# EAGLE design beteigeuze5 (EAGLE 4.16)
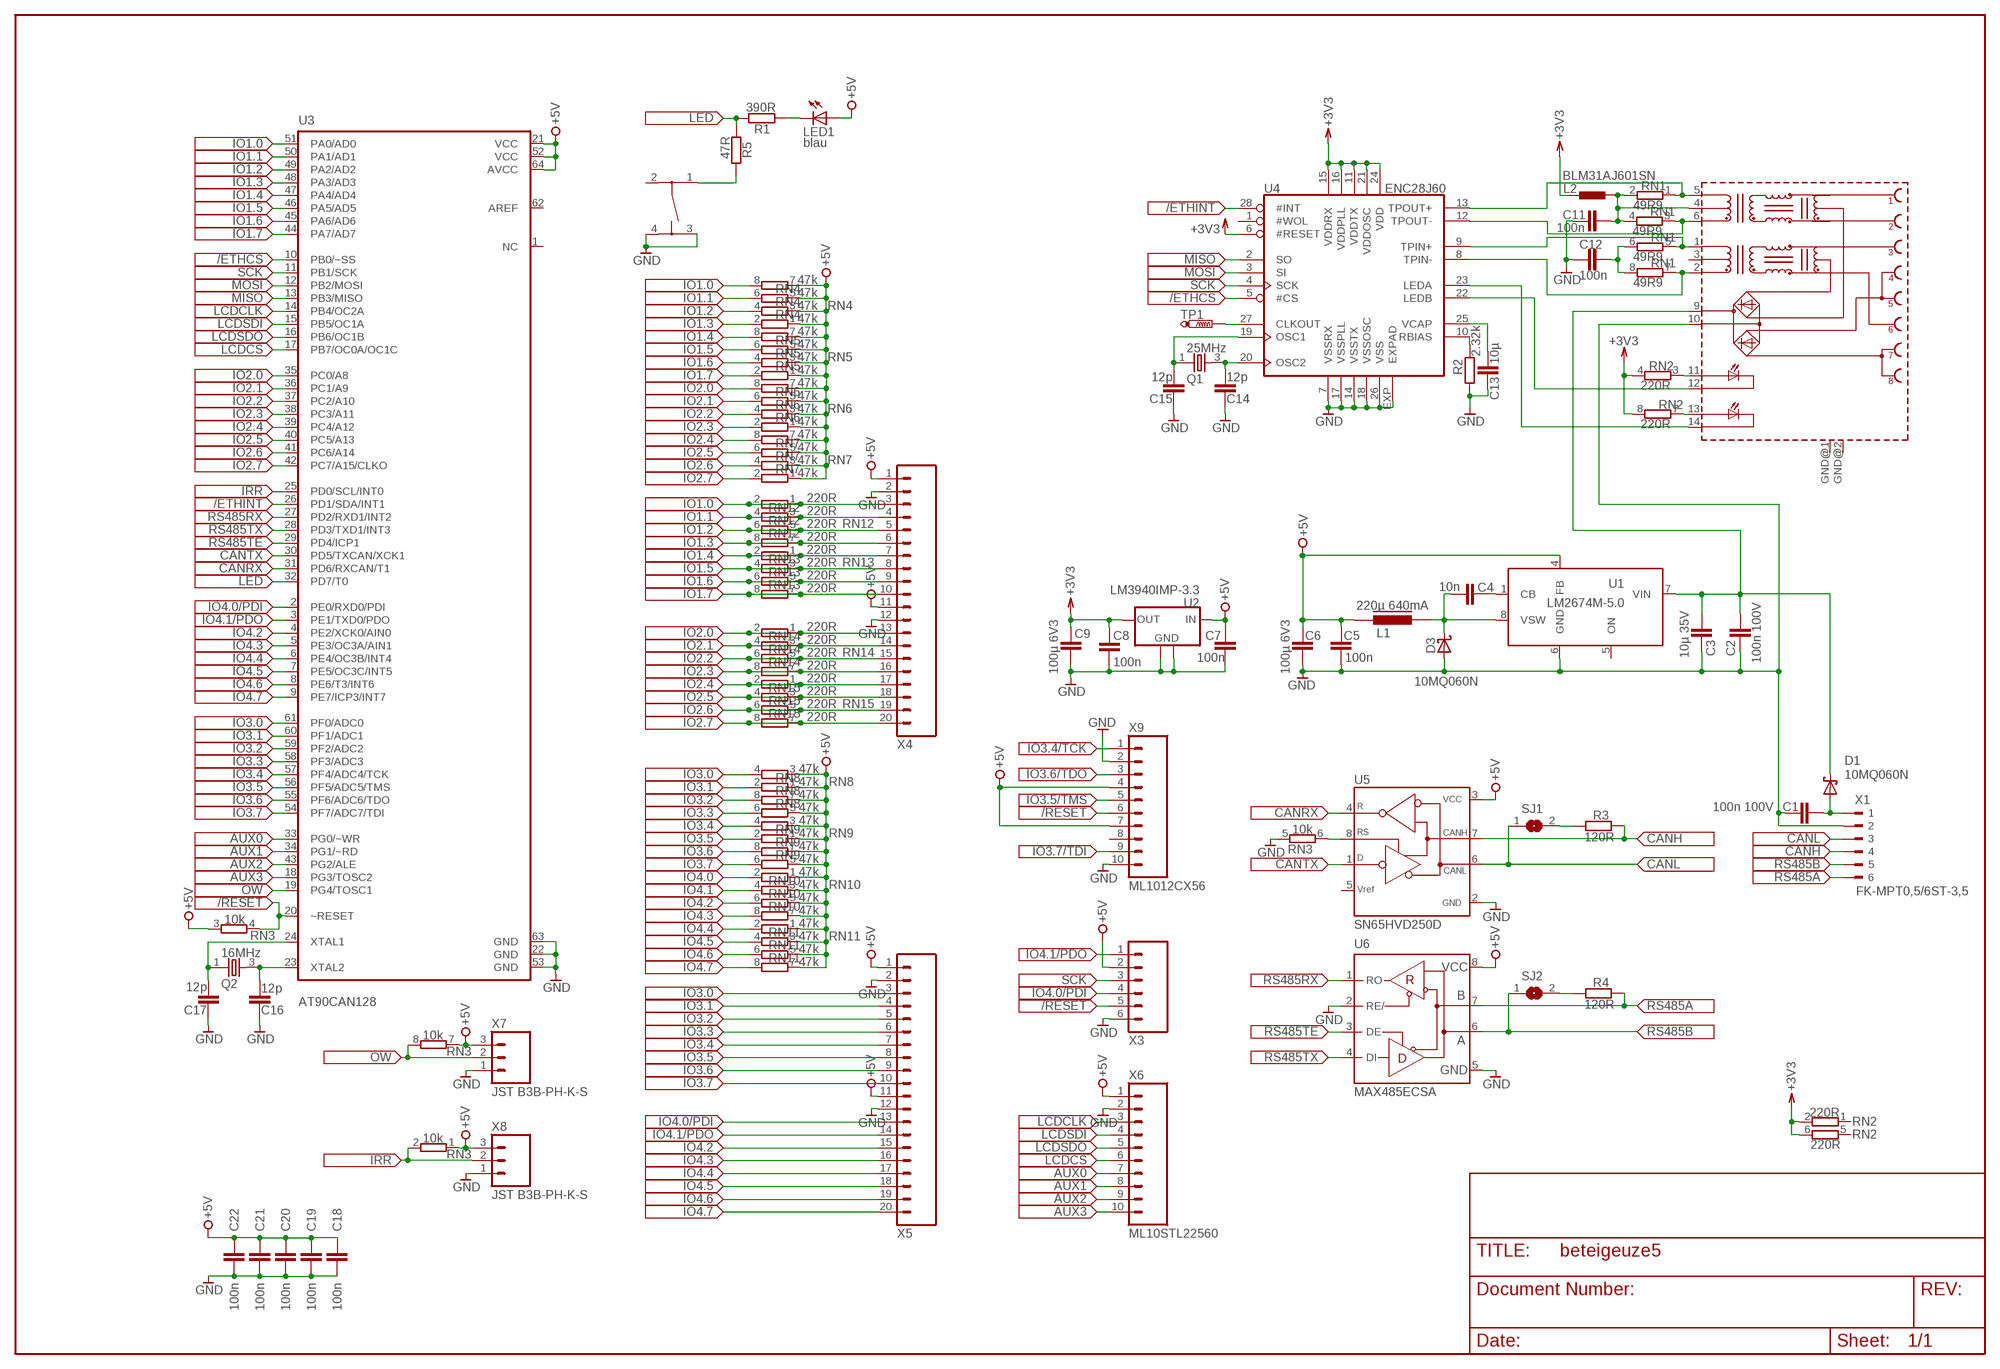
[diagram p0: schematic, sheet 1]

## Parts
C1  100n 100V  C-EUC1206  [C1206]
C2  100n 100V  C-EUC1206  [C1206]
C3  10µ 35V  C-EUC1210  [C1210]
C4  10n  C-EUC0603  [C0603]
C5  100n  C-EUC0603  [C0603]
C6  100µ 6V3  C-EUC1210  [C1210]
C7  100n  C-EUC0603  [C0603]
C8  100n  C-EUC0603  [C0603]
C9  100µ 6V3  C-EUC1210  [C1210]
C11  100n  C-EUC0603  [C0603]
C12  100n  C-EUC0603  [C0603]
C13  10µ  C-EUC0603  [C0603]
C14  12p  C-EUC0603  [C0603]
C15  12p  C-EUC0603  [C0603]
C16  12p  C-EUC0603  [C0603]
C17  12p  C-EUC0603  [C0603]
C18  100n  C-EUC0603  [C0603]
C19  100n  C-EUC0603  [C0603]
C20  100n  C-EUC0603  [C0603]
C21  100n  C-EUC0603  [C0603]
C22  100n  C-EUC0603  [C0603]
D1  10MQ060N  SCHOTTKY-DIODESMA  [SMA]
D3  10MQ060N  SCHOTTKY-DIODESMA  [SMA]
L1  220µ 640mA  07HCP  [07HCP]
L2  BLM31AJ601SN  L-EUL1206  [C1206K]
LED1  blau  LEDCHIP-LED0805  [CHIP-LED0805]
Q1  25MHz  QXO32  [XO32]
Q2  16MHz  QXO32  [XO32]
R1  390R  R-EU_0603  [C0603]
R2  2.32k  R-EU_0603  [C0603]
R3  120R  R-EU_0603  [C0603]
R4  120R  R-EU_0603  [C0603]
R5  47R  R-EU_0603  [C0603]
RN1  49R9  E4RP  [BCN16]
RN2  220R  E4RP  [BCN16]
RN3  10k  E4RP  [BCN16]
RN4  47k  E4RP  [BCN16]
RN5  47k  E4RP  [BCN16]
RN6  47k  E4RP  [BCN16]
RN7  47k  E4RP  [BCN16]
RN8  47k  E4RP  [BCN16]
RN9  47k  E4RP  [BCN16]
RN10  47k  E4RP  [BCN16]
RN11  47k  E4RP  [BCN16]
RN12  220R  E4RP  [BCN16]
RN13  220R  E4RP  [BCN16]
RN14  220R  E4RP  [BCN16]
RN15  220R  E4RP  [BCN16]
SJ1  SJN  [SJJ]
SJ2  SJN  [SJJ]
TP1  PTR1TP06R  [TP06R]
U1  LM2674M-5.0  LM2674M  [SO8]
U2  LM3940IMP-3.3  LM3940-3.3IMP  [SOT223]
U3  AT90CAN128  AT90CAN16AU  [TQFP64]
U4  ENC28J60  ENC28J60I/ML  [QNF28]
U5  SN65HVD250D  SN65HVD230DESA  [SO8]
U6  MAX485ECSA  MAX3072ECSA  [SO8]
U$1  MENTOR1254PHAP3301  [PHAP3301]
X1  FK-MPT0,5/6ST-3,5  [FK-MPT0,5/6ST-3,5]
X3  ML6M  [STL22-560LPGGG6]
X4  ML20STL22-560  [STL22-560LPGGG20]
X5  ML20STL22-560  [STL22-560LPGGG20]
X6  ML10STL22560  [STL22-560LPGGG10]
X7  JST B3B-PH-K-S  CON03PPH-K-S  [B3B-PH-K-S]
X8  JST B3B-PH-K-S  CON03PPH-K-S  [B3B-PH-K-S]
X9  ML1012CX56  [12CX56-010G]
X10  MIC66211-5171MIC66211-5171  [RJPLB-203TC1X]

## Nets
+3V3: C8.2 C9.2 L2.1 RN2.2 RN2.4 RN2.6 RN2.8 U2.3(OUT) U4.6(#RESET) U4.11(VDDTX) U4.15(VDDRX) U4.16(VDDPLL) U4.21(VDDOSC) U4.24(VDD)
+5V: C5.2 C6.2 C7.2 C18.2 C19.2 C20.2 C21.2 C22.2 L1.1 LED1.A RN3.1 RN3.3 RN3.7 RN4.1 RN4.3 RN4.5 RN4.7 RN5.1 RN5.3 RN5.5 RN5.7 RN6.1 RN6.3 RN6.5 RN6.7 RN7.1 RN7.3 RN7.5 RN7.7 RN8.1 RN8.3 RN8.5 RN8.7 RN9.1 RN9.3 RN9.5 RN9.7 RN10.1 RN10.3 RN10.5 RN10.7 RN11.1 RN11.3 RN11.5 RN11.7 U1.4(FB) U2.1(IN) U3.21(VCC) U3.52(VCC) U3.64(AVCC) U5.3(VCC) U6.8(VCC) X3.2 X4.1 X4.11 X5.1 X5.11 X6.1 X7.3 X8.3 X9.4 X9.7
/ETHCS: U3.10(PB0/~SS) U4.5(#CS)
/ETHINT: U3.26(PD1/SDA/INT1) U4.28(#INT)
/RESET: RN3.4 U3.20(~RESET) X3.5 X9.6
AUX0: U3.33(PG0/~WR) X6.7
AUX1: U3.34(PG1/~RD) X6.8
AUX2: U3.43(PG2/ALE) X6.9
AUX3: U3.18(PG3/TOSC2) X6.10
CANH: R3.2 U5.7(CANH) X1.4
CANL: SJ1.1 U5.6(CANL) X1.3
CANRX: U3.31(PD6/RXCAN/T1) U5.4(R)
CANTX: U3.30(PD5/TXCAN/XCK1) U5.1(D)
CB: C4.1 U1.1(CB)
GND: C1.1 C2.2 C3.1 C5.1 C6.1 C7.1 C8.1 C9.1 C11.1 C12.1 C13.1 C14.1 C15.1 C16.1 C17.1 C18.1 C19.1 C20.1 C21.1 C22.1 D3.A R2.1 RN3.5 U1.6(GND) U2.2(GND) U2.4(GND) U3.22(GND) U3.53(GND) U3.63(GND) U4.7(VSSRX) U4.14(VSSTX) U4.17(VSSPLL) U4.18(VSSOSC) U4.26(VSS) U4.EXP(EXPAD) U5.2(GND) U6.2(RE/) U6.5(GND) U$1.3(A) U$1.4(A) X1.2 X3.6 X4.2 X4.12 X5.2 X5.12 X6.2 X7.1 X8.1 X9.2 X9.10 X10.10(PW-)
IO1.0: RN4.8 RN12.1 RN12.2 U3.51(PA0/AD0) X4.3
IO1.1: RN4.6 RN12.3 RN12.4 U3.50(PA1/AD1) X4.4
IO1.2: RN4.4 RN12.5 RN12.6 U3.49(PA2/AD2) X4.5
IO1.3: RN4.2 RN12.7 RN12.8 U3.48(PA3/AD3) X4.6
IO1.4: RN5.8 RN13.1 RN13.2 U3.47(PA4/AD4) X4.7
IO1.5: RN5.6 RN13.3 RN13.4 U3.46(PA5/AD5) X4.8
IO1.6: RN5.4 RN13.5 RN13.6 U3.45(PA6/AD6) X4.9
IO1.7: RN5.2 RN13.7 RN13.8 U3.44(PA7/AD7) X4.10
IO2.0: RN6.8 RN14.1 RN14.2 U3.35(PC0/A8) X4.13
IO2.1: RN6.6 RN14.3 RN14.4 U3.36(PC1/A9) X4.14
IO2.2: RN6.4 RN14.5 RN14.6 U3.37(PC2/A10) X4.15
IO2.3: RN6.2 RN14.7 RN14.8 U3.38(PC3/A11) X4.16
IO2.4: RN7.8 RN15.1 RN15.2 U3.39(PC4/A12) X4.17
IO2.5: RN7.6 RN15.3 RN15.4 U3.40(PC5/A13) X4.18
IO2.6: RN7.4 RN15.5 RN15.6 U3.41(PC6/A14) X4.19
IO2.7: RN7.2 RN15.7 RN15.8 U3.42(PC7/A15/CLKO) X4.20
IO3.0: RN8.4 U3.61(PF0/ADC0) X5.3
IO3.1: RN8.2 U3.60(PF1/ADC1) X5.4
IO3.2: RN8.8 U3.59(PF2/ADC2) X5.5
IO3.3: RN8.6 U3.58(PF3/ADC3) X5.6
IO3.4: RN9.4 U3.57(PF4/ADC4/TCK) X5.7 X9.1
IO3.5: RN9.2 U3.56(PF5/ADC5/TMS) X5.8 X9.5
IO3.6: RN9.8 U3.55(PF6/ADC6/TDO) X5.9 X9.3
IO3.7: RN9.6 U3.54(PF7/ADC7/TDI) X5.10 X9.9
IO4.0/PDI: RN10.2 U3.2(PE0/RXD0/PDI) X3.4 X5.13
IO4.1/PDO: RN10.4 U3.3(PE1/TXD0/PDO) X3.1 X5.14
IO4.2: RN10.6 U3.4(PE2/XCK0/AIN0) X5.15
IO4.3: RN10.8 U3.5(PE3/OC3A/AIN1) X5.16
IO4.4: RN11.2 U3.6(PE4/OC3B/INT4) X5.17
IO4.5: RN11.4 U3.7(PE5/OC3C/INT5) X5.18
IO4.6: RN11.6 U3.8(PE6/T3/INT6) X5.19
IO4.7: RN11.8 U3.9(PE7/ICP3/INT7) X5.20
IRR: RN3.2 U3.25(PD0/SCL/INT0) X8.2
KEY: R5.2 U$1.1(B)
LCDCLK: U3.14(PB4/OC2A) X6.3
LCDCS: U3.17(PB7/OC0A/OC1C) X6.6
LCDSDI: U3.15(PB5/OC1A) X6.4
LCDSDO: U3.16(PB6/OC1B) X6.5
LED: R1.2 R5.1 U3.32(PD7/T0)
LEDA: U4.23(LEDA) X10.14(D2K)
LEDB: U4.22(LEDB) X10.12(D1K)
MISO: U3.13(PB3/MISO) U4.2(SO)
MOSI: U3.12(PB2/MOSI) U4.3(SI)
N$1: TP1.TP U4.27(CLKOUT)
N$7: C11.2 L2.2 RN1.2 RN1.4 X10.4(TCT)
N$8: C12.2 RN1.6 RN1.8
N$14: LED1.C R1.1
N$23: RN3.6 U5.8(RS)
N$24: R3.1 SJ1.2
N$25: RN2.3 X10.11(D1A)
N$26: R4.1 SJ2.2
N$29: RN2.7 X10.13(D2A)
OSC1: C15.2 Q1.1 U4.19(OSC1)
OSC2: C14.2 Q1.3 U4.20(OSC2)
OW: RN3.8 U3.19(PG4/TOSC1) X7.2
RBIAS: R2.2 U4.10(RBIAS)
RS485A: R4.2 U6.7(B) X1.6
RS485B: SJ2.1 U6.6(A) X1.5
RS485RX: U3.27(PD2/RXD1/INT2) U6.1(RO)
RS485TE: U3.29(PD4/ICP1) U6.3(DE)
RS485TX: U3.28(PD3/TXD1/INT3) U6.4(DI)
SCK: U3.11(PB1/SCK) U4.4(SCK) X3.3
TPIN+: RN1.5 U4.9(TPIN+) X10.1(RD+)
TPIN-: RN1.7 U4.8(TPIN-) X10.2(RD-)
TPOUT+: RN1.1 U4.13(TPOUT+) X10.5(TD+)
TPOUT-: RN1.3 U4.12(TPOUT-) X10.6(TD-)
VCAP: C13.2 U4.25(VCAP)
VIN: C2.1 C3.2 D1.C U1.7(VIN) X10.9(PW+)
VSUP: C1.2 D1.A X1.1
VSW: C4.2 D3.C L1.2 U1.8(VSW)
XTAL1: C17.2 Q2.1 U3.24(XTAL1)
XTAL2: C16.2 Q2.3 U3.23(XTAL2)
Unconnected: RN2.1 RN2.5 U1.5(ON) U3.1(NC) U3.62(AREF) U4.1(#WOL) U5.5(VREF) U$1.2(B) X9.8 X10.3(RCT) X10.GND@1(SHLD) X10.GND@2(SHLD)

## Library data of the parts
C1-C9 C11-C22 = rcl:C-EU: CAPACITOR, European symbol
D1 D3 = diode:SCHOTTKY-DIODE: Schottky Diode
L1 = inductor-fastron:07HCP
L2 = rcl:L-EU: INDUCTOR, European symbol
LED1 = led:LED: LED OSRAM: - CHIPLED LG R971, LG N971, LY N971, LG Q971, LY Q971, LO R971, LY R971 LH N974, LH R974 LS Q976, LO Q976, LY Q976 LO Q996 - Hyper CHIPLED LW Q18S LB Q993, LB Q99A, LB R99A - SideLED LS A670, LO A670, LY A670, LG A670, LP A670 LB A673, LV A673, LT A673, LW A673 LH A674 LY A675 LS A676, LA A676, LO A676, LY A676, LW A676 LS A679, LY A679, LG A679 - Hyper Micro SIDELED® LS Y876, LA Y876, LO Y876, LY Y876 LT Y87S - SmartLED LW L88C, LW L88S LB L89C, LB L89S, LG L890 LS L89K, LO L89K, LY L89K LS L896, LA L896, LO L896, LY L896 - TOPLED LS T670, LO T670, LY T670, LG T670, LP T670 LSG T670, LSP T670, LSY T670, LOP T670, LYG T670 LG T671, LOG T671, LSG T671 LB T673, LV T673, LT T673, LW T673 LH T674 LS T676, LA T676, LO T676, LY T676, LB T676, LH T676, LSB T676, LW T676 LB T67C, LV T67C, LT T67C, LS T67K, LO T67K, LY T67K, LW E67C LS E67B, LA E67B, LO E67B, LY E67B, LB E67C, LV E67C, LT E67C LW T67C LS T679, LY T679, LG T679 LS T770, LO T770, LY T770, LG T770, LP T770 LB T773, LV T773, LT T773, LW T773 LH T774 LS E675, LA E675, LY E675, LS T675 LS T776, LA T776, LO T776, LY T776, LB T776 LHGB T686 LT T68C, LB T68C - Hyper Mini TOPLED® LB M676 - Mini TOPLED Santana® LG M470 LS M47K, LO M47K, LY M47K Source: http://www.osram.convergy.de - LUMILED® LXK2-PW12-R00, LXK2-PW12-S00, LXK2-PW14-U00, LXK2-PW14-V00 LXK2-PM12-R00, LXK2-PM12-S00, LXK2-PM14-U00 LXK2-PE12-Q00, LXK2-PE12-R00, LXK2-PE12-S00, LXK2-PE14-T00, LXK2-PE14-U00 LXK2-PB12-K00, LXK2-PB12-L00, LXK2-PB12-M00, LXK2-PB14-N00, LXK2-PB14-P00, LXK2-PB14-Q00 LXK2-PR12-L00, LXK2-PR12-M00, LXK2-PR14-Q00, LXK2-PR14-R00 LXK2-PD12-Q00, LXK2-PD12-R00, LXK2-PD12-S00 LXK2-PH12-R00, LXK2-PH12-S00 LXK2-PL12-P00, LXK2-PL12-Q00, LXK2-PL12-R00 Source: www.luxeon.com
Q1 Q2 = _frank:Q: CRYSTAL
R1-R5 = rcl:R-EU_: RESISTOR, European symbol
RN1-RN15 = _frank:E4RP: SIL RESISTOR
SJ1 SJ2 = jumper:SJ: SMD solder JUMPER
TP1 = testpad:PTR1: TEST PIN
U1 = lm-switching-regulator:LM2674
U2 = v-reg:LM3940*-3.3
U3 = AT90CAN:AT90CAN
U4 = ENC28J60:ENC28J60
U5 = _frank:SN65HVD230D: CANBUS TRANSEIVER
U6 = _frank:MAX3072E
U$1 = switch:MENTOR1254
X1 = con-phoenix-fkmpt35:FK-MPT0,5/6ST-3,5
X3 = con-harting-ml:ML6: HARTING
X4 X5 = con-harting-ml:ML20: HARTING
X6 X9 = con-harting-ml:ML10: HARTING
X7 X8 = _frank:CON03P
X10 = _frank:MIC66211-5171

## Board
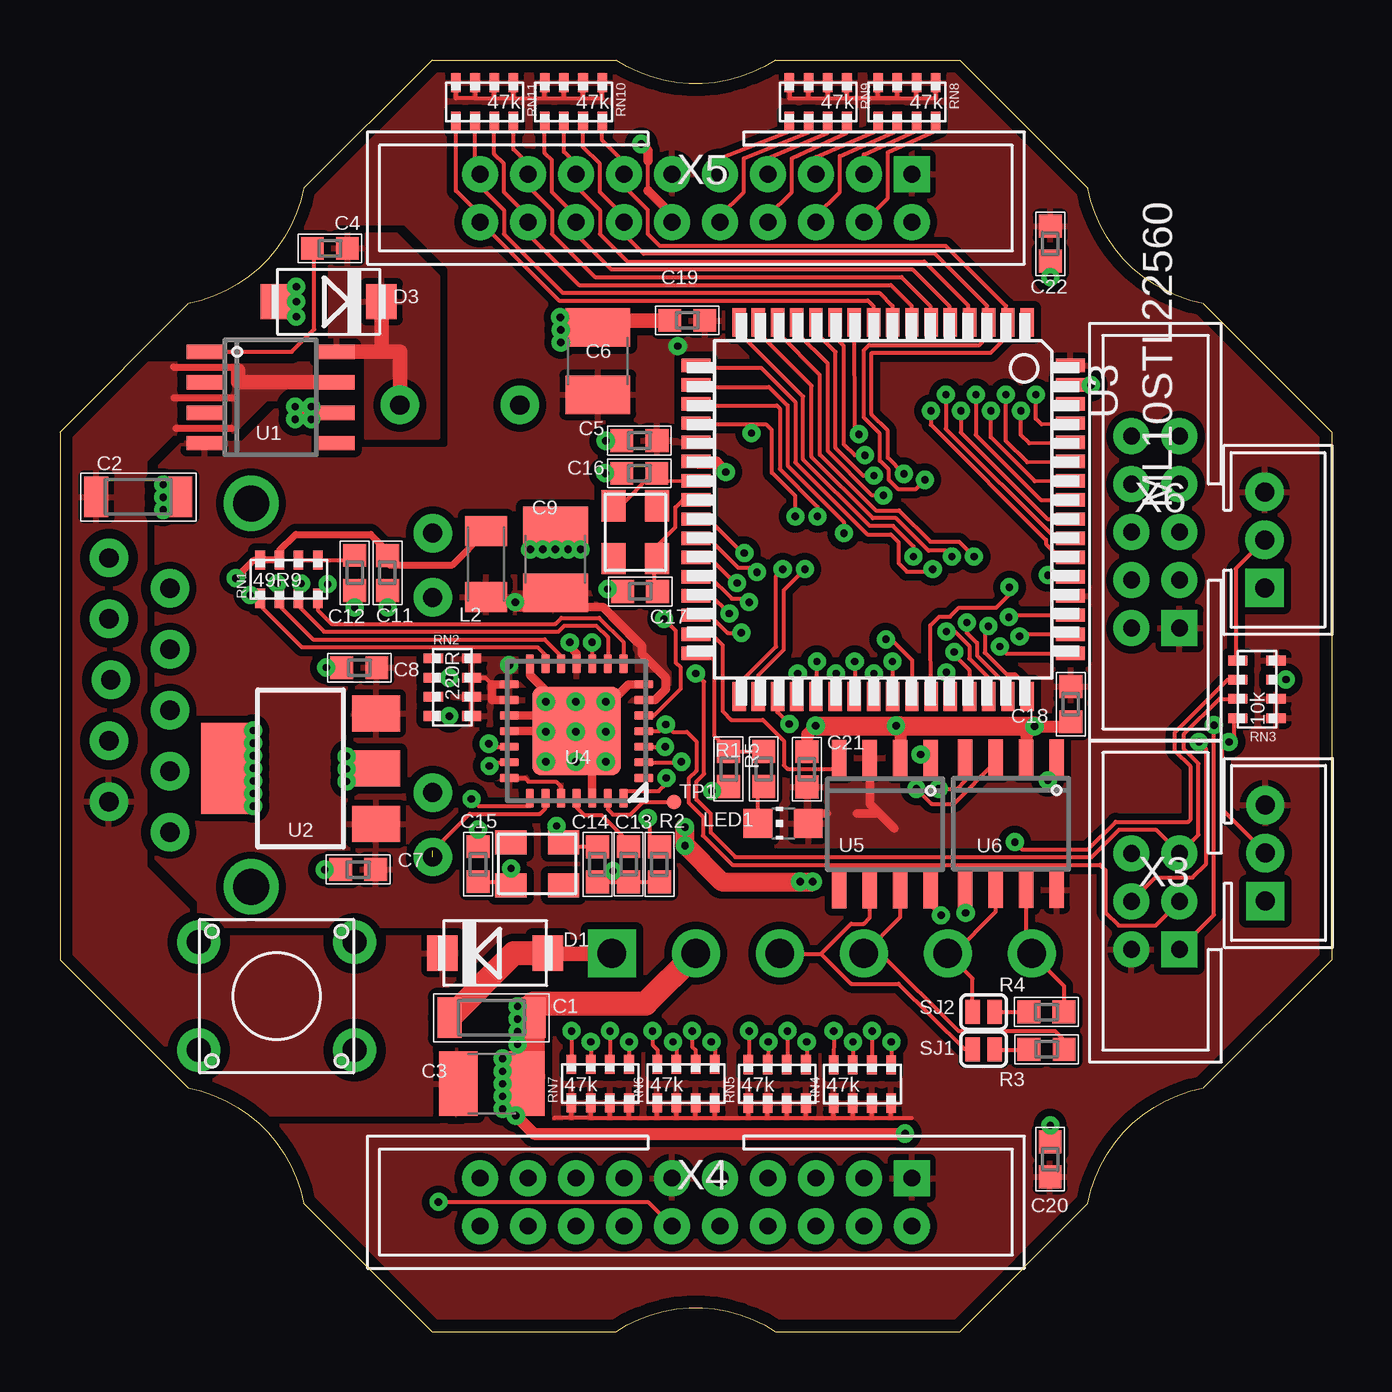
[diagram p1: board, top side]
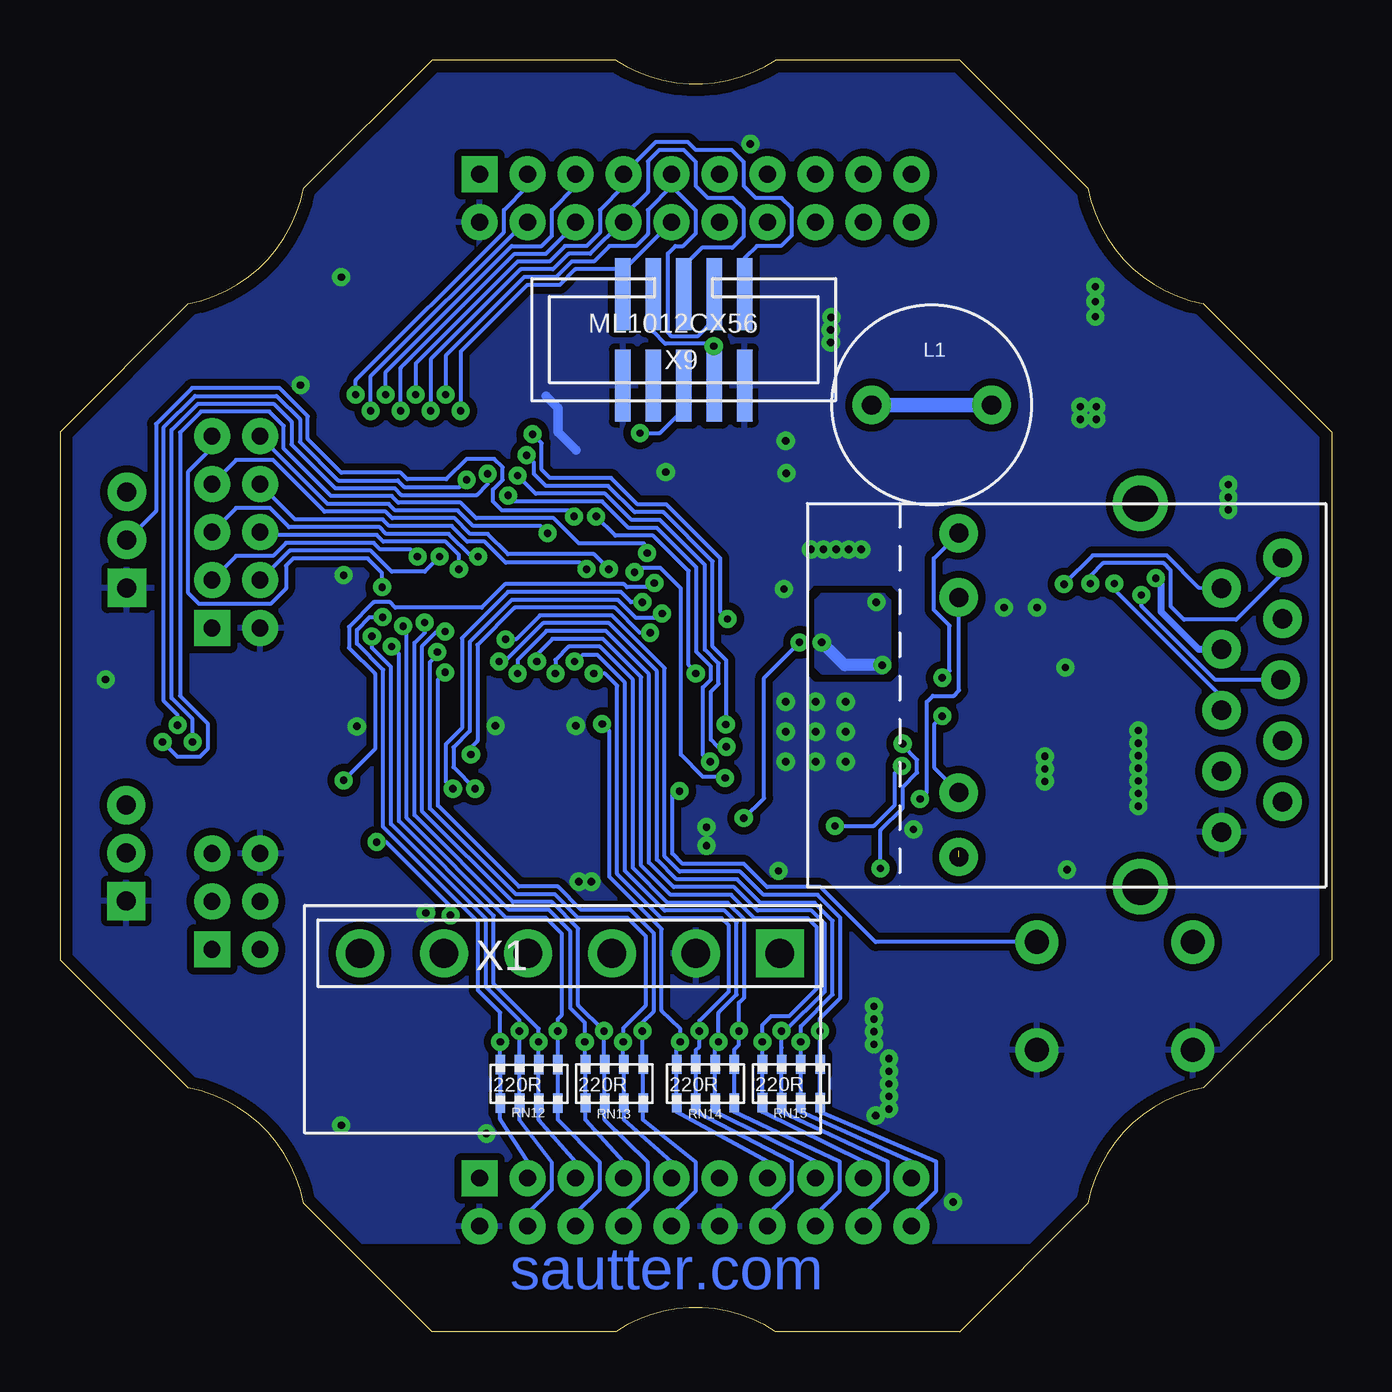
[diagram p2: board, bottom side, seen from below]

Size 53 x 53 mm. Coordinates in mm from the lower left corner, seen from the top.
Outline: 37.5,53 42.85,47.65 arc69 47.65,42.85 53,37.5 53,15.5 47.65,10.15 arc69 42.85,5.35 37.5,0 29.82,0 arc67 23.18,0 15.5,0 10.15,5.35 arc69 5.35,10.15 0,15.5 0,37.5 5.35,42.85 arc69 10.15,47.65 15.5,53 23.18,53 arc67 29.82,53 37.5,53
Copper layers (1*16): Top 0.035mm / dielectric 1.5mm / Bottom 0.035mm
Design rules "default": minimum track width 6mil, minimum drill 0.3mm, track to track 6mil, track to pad 6mil, pad to pad 6mil, via to via 6mil, smd to smd 6mil, copper to edge 20mil, drill to drill 8mil, minimum pad ring 0.4mm, minimum via ring 9mil, stop-mask expansion 6mil, vias tented up to drill 13mil, thermal gap 10mil

### Footprints (pad centres in the part's own frame; a part is rotated, then mirrored left to right if it is on the bottom)
C1206 = smd 1 x 1.7: 1 -1.75,0; 2 1.75,0
C1210 = smd 1.6 x 2.7: 1 -1.4,0; 2 1.4,0
C0603 = smd 0.95 x 0.95: 1 -0.731,0; 2 0.731,0
SMA = smd 1.27 x 1.473: A 2.2,0; C -2.2,0
07HCP = drill 0.8 round: 1 -2.5,0; 2 2.5,0
C1206K = smd 1.25 x 1.75: 1 -1.375,0; 2 1.375,0
CHIP-LED0805 = smd 1.2 x 1.2: A 0,-1.05; C 0,1.05
XO32 = smd 1.3 x 1: 1 -1.1,-0.9; 2 1.1,-0.9; 3 1.1,0.9; 4 -1.1,0.9
BCN16 = smd 0.4 x 0.8: 1 -1.2,-0.8; 2 -1.2,0.8; 3 -0.4,-0.8; 4 -0.4,0.8; 5 0.4,-0.8; 6 0.4,0.8; 7 1.2,-0.8; 8 1.2,0.8
SJJ = smd 0.6 x 1: 1 -0.462,0; 2 0.462,0
TP06R = smd 0.6 x 0.6: TP 0,0
SO8 = smd 0.6 x 1.5: 1 -1.905,-2.759; 2 -0.635,-2.759; 3 0.635,-2.759; 4 1.905,-2.759; 5 1.905,2.759; 6 0.635,2.759; 7 -0.635,2.759; 8 -1.905,2.759
SOT223 = smd 1.5 x 2: 1 -2.3,-3.15; 2 0,-3.15; 3 2.3,-3.15 | smd 3.8 x 2: 4 0,3.15
TQFP64 = smd 1.2 x 0.56: 1 -7.8,6; 2 -7.8,5.2; 3 -7.8,4.4; 4 -7.8,3.6; 5 -7.8,2.8; 6 -7.8,2; 7 -7.8,1.2; 8 -7.8,0.4; 9 -7.8,-0.4; 10 -7.8,-1.2; 11 -7.8,-2; 12 -7.8,-2.8; 13 -7.8,-3.6; 14 -7.8,-4.4; 15 -7.8,-5.2; 16 -7.8,-6; 33 7.8,-6; 34 7.8,-5.2; 35 7.8,-4.4; 36 7.8,-3.6; 37 7.8,-2.8; 38 7.8,-2; 39 7.8,-1.2; 40 7.8,-0.4; 41 7.8,0.4; 42 7.8,1.2; 43 7.8,2; 44 7.8,2.8; 45 7.8,3.6; 46 7.8,4.4; 47 7.8,5.2; 48 7.8,6 | smd 0.56 x 1.2: 17 -6,-7.8; 18 -5.2,-7.8; 19 -4.4,-7.8; 20 -3.6,-7.8; 21 -2.8,-7.8; 22 -2,-7.8; 23 -1.2,-7.8; 24 -0.4,-7.8; 25 0.4,-7.8; 26 1.2,-7.8; 27 2,-7.8; 28 2.8,-7.8; 29 3.6,-7.8; 30 4.4,-7.8; 31 5.2,-7.8; 32 6,-7.8; 49 6,7.8; 50 5.2,7.8; 51 4.4,7.8; 52 3.6,7.8; 53 2.8,7.8; 54 2,7.8; 55 1.2,7.8; 56 0.4,7.8; 57 -0.4,7.8; 58 -1.2,7.8; 59 -2,7.8; 60 -2.8,7.8; 61 -3.6,7.8; 62 -4.4,7.8; 63 -5.2,7.8; 64 -6,7.8
QNF28 = smd 0.8 x 0.35: 1 -2.8,1.95; 2 -2.8,1.3; 3 -2.8,0.65; 4 -2.8,0; 5 -2.8,-0.65; 6 -2.8,-1.3; 7 -2.8,-1.95; 15 2.8,-1.95; 16 2.8,-1.3; 17 2.8,-0.65; 18 2.8,0; 19 2.8,0.65; 20 2.8,1.3; 21 2.8,1.95 | smd 0.35 x 0.8: 8 -1.95,-2.8; 9 -1.3,-2.8; 10 -0.65,-2.8; 11 0,-2.8; 12 0.65,-2.8; 13 1.3,-2.8; 14 1.95,-2.8; 22 1.95,2.8; 23 1.3,2.8; 24 0.65,2.8; 25 0,2.8; 26 -0.65,2.8; 27 -1.3,2.8; 28 -1.95,2.8 | smd 3.7 x 3.7: EXP 0,0
PHAP3301 = drill 1 pad 1.4 round: 1 -3.25,-2.25; 2 3.25,-2.25; 3 -3.25,2.25; 4 3.25,2.25
FK-MPT0,5/6ST-3,5 = drill 1.2 pad 2 square: 1 -8.75,0 | drill 1.2 pad 2 round: 2 -5.25,0; 3 -1.75,0; 4 1.75,0; 5 5.25,0; 6 8.75,0
STL22-560LPGGG6 = drill 0.7 square: 1 -2,-1 | drill 0.7 round: 2 -2,1; 3 0,-1; 4 0,1; 5 2,-1; 6 2,1
STL22-560LPGGG20 = drill 0.7 square: 1 -9,-1 | drill 0.7 round: 2 -9,1; 3 -7,-1; 4 -7,1; 5 -5,-1; 6 -5,1; 7 -3,-1; 8 -3,1; 9 -1,-1; 10 -1,1; 11 1,-1; 12 1,1; 13 3,-1; 14 3,1; 15 5,-1; 16 5,1; 17 7,-1; 18 7,1; 19 9,-1; 20 9,1
STL22-560LPGGG10 = drill 0.7 square: 1 -4,-1 | drill 0.7 round: 2 -4,1; 3 -2,-1; 4 -2,1; 5 0,-1; 6 0,1; 7 2,-1; 8 2,1; 9 4,-1; 10 4,1
B3B-PH-K-S = drill 0.8 pad 1.4 square: 1 0,-2 | drill 0.8 pad 1.4 round: 2 0,0; 3 0,2
12CX56-010G = smd 0.65 x 3: 1 -2.54,-1.905; 2 -2.54,1.905; 3 -1.27,-1.905; 4 -1.27,1.905; 5 0,-1.905; 6 0,1.905; 7 1.27,-1.905; 8 1.27,1.905; 9 2.54,-1.905; 10 2.54,1.905
RJPLB-203TC1X = drill 0.8 pad 1.4 round: 1 -5.715,8.97; 2 -4.445,6.43; 3 -3.175,8.97; 4 -1.905,6.43; 5 -0.635,8.89; 6 0.635,6.43; 7 1.905,8.97; 8 3.175,6.43; 9 4.445,8.97; 10 5.715,6.43; 11 -6.747,-4.524; 12 -4.067,-4.524; 13 4.067,-4.524; 14 6.747,-4.524 | drill 1.5 round: GND@1 -7.99,3.046; GND@2 7.99,3.046

### Placement (x,y rotation side)
C1  17.98,13.08 180 top
C2  3.27,34.79 0 top
C3  18,10.33 180 top
C4  11.25,45.15 0 top
C5  24.15,37.13 0 top
C6  22.42,40.45 270 top
C7  12.43,19.25 0 top
C8  12.47,27.67 0 top
C9  20.65,32.19 270 top
C11  13.65,31.62 90 top
C12  12.29,31.62 90 top
C13  23.7,19.48 90 top
C14  22.4,19.47 90 top
C15  17.43,19.48 270 top
C16  24.14,35.77 0 top
C17  24.18,30.85 0 top
C18  42.13,26.15 90 top
C19  26.14,42.15 0 top
C20  41.27,7.18 270 top
C21  31.13,23.43 270 top
C22  41.27,45.34 90 top
D1  18.14,15.77 0 top
D3  11.2,42.92 180 top
L1  16.67,38.62 180 bottom
L2  17.76,31.99 90 top
LED1  30.14,21.18 90 top
Q1  19.89,19.5 0 top
Q2  23.98,33.31 90 top
R1  29.33,23.45 90 top
R2  24.98,19.47 90 top
R3  41.12,11.77 0 top
R4  41.12,13.32 0 top
R5  27.87,23.45 270 top
RN1  9.54,31.36 0 top
RN2  16.36,26.86 270 top
RN3  49.89,26.77 90 top
RN4  33.45,10.32 0 top
RN5  29.89,10.32 0 top
RN6  26.09,10.33 0 top
RN7  22.52,10.34 0 top
RN8  35.3,51.25 180 top
RN9  31.6,51.25 180 top
RN10  21.4,51.25 180 top
RN11  17.7,51.25 180 top
RN12  33.45,10.32 0 bottom
RN13  29.89,10.33 0 bottom
RN14  26.09,10.34 0 bottom
RN15  22.52,10.34 0 bottom
SJ1  38.5,11.77 0 top
SJ2  38.5,13.32 0 top
TP1  25.6,22.07 0 top
U1  8.78,38.94 270 top
U2  10.03,23.46 90 top
U3  34.31,34.27 270 top
U4  21.54,25.02 180 top
U5  34.39,21.15 180 top
U6  39.64,21.17 180 top
U$1  9.03,13.98 180 top
X1  31.75,15.77 180 bottom
X3  45.66,17.93 90 top
X4  26.5,5.39 180 top
X5  26.5,47.24 180 top
X6  45.66,33.32 90 top
X7  50.22,32.99 0 top
X8  50.24,19.95 0 top
X9  27,41.34 180 bottom
X10  11.01,26.53 270 bottom

### Tracks (layer width: path | path; a pad name or v marks a point on that pad's centre or on a via)
+3V3  (via drill 0.3)
  Top 0.16: RN2.4 17.18,27.25 17.16,27.23 | RN2.4 17.16,27.23 | RN2.4 | RN2.4 | RN2.4 | RN2.4 17.72,27.25 18,26.98 | RN2.8 17.15,26.45 | RN2.6 17.15,27.23 17.16,27.23 | U4.21 19.38,23.07 19.52,22.93 20.68,22.93 20.88,22.73 20.88,22.23 U4.24
  Top 0.35: U4.11 21.54,28.27 21.25,28.55 v21.25,28.73 | U4.6 24.8,26.32 25.25,26.77 25.25,27.25 24.25,28.25 24.25,28.57 22.62,30.2 | U4.15 18,26.98 18,26.32 U4.16 | 22.62,30.2 21.48,30.2 20.12,30.2 | 22.62,30.2 24.05,28.75
  Top 0.4: L2.1 17.75,30.62 | L2.1 | L2.1 17.75,30.4 v18.98,30.4 18.98,30.2 21.48,30.2
  Bottom 0.5: v21.25,28.73 20.3,27.77 v18.73,27.77
  pour Top (isolate 0.3): 12.25,29.75 16.25,29.75 16.25,31.5 22.75,31.5 22.75,30.5 27,30.5 27,22.25 14.47,22.2 14.47,24.45 12.22,24.45
  pour Bottom (isolate 0.3, no thermals): 18.43,27.73 18.43,30.45 18.68,30.7 21.25,30.7 21.5,30.45 21.5,27.73 21.25,27.48 18.68,27.48
+5V  (via drill 0.3)
  Top 0.16: RN5.1 28.7,8.9 | 29.5,8.9 30.3,8.9 | 28.7,8.9 29.5,8.9 | 30.3,8.9 31.1,8.9 | 31.1,8.9 32.25,8.9 | 32.25,8.9 33.05,8.9 | 33.05,8.9 33.85,8.9 | 33.85,8.9 34.65,8.9 | 32.25,8.9 32.25,9 32.24,9 RN4.1 | RN4.3 33.05,8.9 | RN4.5 33.84,8.9 33.85,8.9 | 34.65,8.9 RN4.7 | 34.65,8.9 | RN5.7 31.09,8.9 31.1,8.9 | RN5.5 30.3,8.9 | RN5.3 29.5,8.9 | RN7.1 21.32,8.9 | 22.12,8.9 21.32,8.9 | 22.12,8.9 22.93,8.9 | 22.93,8.9 23.73,8.9 | 23.73,8.9 24.9,8.9 | 24.9,8.9 25.52,8.9 | 25.52,8.9 25.7,8.9 | 25.7,8.9 26.5,8.9 | 26.5,8.9 27.3,8.9 | RN6.7 27.3,8.9 | RN6.5 26.5,8.9 | RN6.3 25.7,8.9 | RN6.1 24.89,8.9 24.9,8.9 | RN7.5 22.92,8.9 22.93,8.9 | RN7.7 23.72,8.9 23.73,8.9 | RN7.3 22.12,8.9 | 27.3,8.9 28.7,8.9 | 25.52,8.9 25.5,8.9 | X4.11 25.52,6.42 | 34.65,8.9 35.5,8.9 | X4.1 | RN9.7 30.4,51.4 31.2,51.4 | 31.2,51.4 RN9.5 | 32,51.4 RN9.3 | 32.8,51.4 RN9.1 | 34.1,51.4 RN8.7 | 34.9,51.4 RN8.5 | 35.7,51.4 RN8.3 | RN8.1 36.5,51.4 35.7,51.4 | RN11.7 16.5,51.4 17.3,51.4 | RN11.5 17.3,51.4 | 18.1,51.4 RN11.3 | 17.3,51.4 18.1,51.4 | 18.9,51.4 RN11.1 | 18.1,51.4 18.9,51.4 | 20.2,51.4 RN10.7 | 18.9,51.4 20.2,51.4 | 21,51.4 RN10.5 | 20.2,51.4 21,51.4 | 21.8,51.4 RN10.3 | 21,51.4 21.8,51.4 | RN10.1 22.6,51.4 21.8,51.4 | 31.2,51.4 32,51.4 | 32,51.4 32.8,51.4 | 34.1,51.4 32.8,51.4 | 34.9,51.4 34.1,51.4 | 34.9,51.4 35.7,51.4 | 31.2,51.4 34.9,51.4 | 21.32,8.9 20.6,8.9
  Top 0.3: 21.77,38.62 21.77,38.6 22.42,38.6 C6.2
  Top 0.35: U5.3 33.76,22 34.15,21.6 | 34.15,21.6 34.77,20.98 | LED1.A 31.2,21.6 31.98,21.6 | 33.23,21.6 34.15,21.6
  Bottom 0.16: X9.7 28.27,41.67 27.77,41.17 25.85,41.17 v25.75,41.08 25.75,39.45 X9.4 | X9.4 | X9.4
  Bottom 0.3: L1.1 19.17,38.62
  pour Top (isolate 0.3, rank 2): 0,37.5 15.5,53 37.5,53 53,37.5 53,15.5 37.5,0 15.5,0 0,15.5
/ETHCS  (via drill 0.3)
  Top 0.16: v25.18,29.7 25.68,29.2 25.68,27.88 25.88,27.68 25.88,26.8 24.75,25.68 U4.5 | U3.10 33.13,37.57 v33.3,37.4
  Bottom 0.16: v25.18,29.7 25.48,30 25.48,32.23 27.73,34.48 28.93,34.48 30.02,35.58 32.58,35.58 32.92,35.92 32.92,37.02 v33.3,37.4
/ETHINT  (via drill 0.3)
  Top 0.16: U3.26 27.02,33.08 28.27,31.82 28.88,31.82 v29.05,31.65 | v25.27,23.07 25.27,22.85 24.95,22.52 23.48,22.52 U4.28
  Bottom 0.16: v25.27,23.07 25.32,23.12 26.2,23.12 27.12,24.05 27.12,30.98 27.98,31.82 28.88,31.82 v29.05,31.65
/RESET  (via drill 0.3)
  Top 0.16: X3.5 45.67,20.93 44.15,20.93 43,19.77 28.15,19.77 27.12,20.8 27.12,21.57 26.52,22.18 26.52,22.93 26.85,23.25 26.85,27.07 v26.5,27.43 | v30.65,33.98 30.65,34.83 29.68,35.8 29.68,37.58 29.45,37.8 28.82,37.8 | X3.5 | U3.20 26.55,37.81 26.55,37.8 28.82,37.8 | 28.82,37.8 v28.82,37.45 | X3.5 46.67,19.93 47.45,20.7 47.45,23.68 46.85,24.27 46.85,24.9 48.33,26.38 RN3.4
  Bottom 0.16: v26.5,27.43 26.8,27.77 26.8,31.7 28.27,33.17 29.85,33.17 v30.65,33.98 | X9.6 27,38.45 28,37.45 v28.82,37.45
AUX0  (via drill 0.3)
  Top 0.16: U3.33 28.39,27.09 29.85,28.55 29.85,31.5 v30.12,31.77
  Bottom 0.16: X6.7 45.66,36.33 44.12,36.33 41.98,34.17 39.42,34.17 39.15,33.9 36.55,33.9 35.9,33.25 35.17,33.25 34.33,32.4 30.75,32.4 v30.12,31.77
AUX1  (via drill 0.3)
  Top 0.16: U3.34 29.11,27.36 30.18,28.43 30.18,30.9 v31.05,31.77
  Bottom 0.16: v31.05,31.77 31.32,32.05 34.42,32.05 35.3,32.92 36.02,32.92 36.67,33.58 39.27,33.58 39.55,33.85 43.2,33.85 X6.8 | X6.8 | X6.8 44.67,35.33
AUX2  (via drill 0.3)
  Top 0.16: U3.43 36.28,29.43 36.65,29.8 37.1,29.8 37.48,30.18 39.02,30.18 39.58,30.73 v39.58,31.02
  Bottom 0.16: X6.9 46.66,36.84 47.65,35.85 47.65,30.77 47.2,30.32 44.23,30.32 43.58,30.98 43.58,31.93 43.27,32.23 40.17,32.23 39.58,31.62 v39.58,31.02 39.58,31
AUX3  (via drill 0.3)
  Top 0.16: v32.67,33.27 32.67,33.75 30.32,36.1 30.32,38.6 29.55,39.38 26.55,39.38 U3.18
  Bottom 0.16: v32.67,33.27 32.98,33.58 35.77,33.58 36.42,34.23 39.02,34.23 39.3,34.5 41.85,34.5 44.67,37.33 | 44.67,37.33 X6.10 44.67,37.33 | 44.67,37.33 44.68,37.32
CANH
  Top 0.16: U5.7 35.02,17.27 33.5,15.75 | R3.2 41.85,12.15 41.48,12.53 37.45,12.53 34.23,15.75 33.5,15.75 | 33.5,15.75 X1.4
CANL
  Top 0.16: U5.6 33.76,17.25 33.5,17 32.98,17 31.73,15.75 | X1.3 30,15.75 31.73,15.75 | SJ1.1 37.7,11.78 34.96,14.5 32.98,14.5 31.73,15.75
CANRX
  Top 0.16: U5.4 32.5,23.93 U5.4 32.48,23.45 30.32,23.45 30.18,23.6 30.18,24.62 29.3,25.5 27.98,25.5 27.62,25.85 27.62,28.6 27.08,29.15 U3.31
CANTX  (via drill 0.3)
  Top 0.16: v28.4,29.12 27.82,29.12 27.02,29.93 U3.30 | 36.27,23.93 U5.1 | U5.1 | v35.88,24.05 36.3,24.05 U5.1
  Bottom 0.16: v28.4,29.12 28.82,29.12 29.88,30.18 34.05,30.18 35.6,28.62 35.6,24.62 35.88,24.35 v35.88,24.05
CB
  Top 0.16: U1.1 9.66,40.84 10.6,41.77 10.6,45.08 C4.1
GND  (via drill 0.3)
  Top 0.152: C7.1 11.43,19.05 v11.03,19.25
  Top 0.16: v13.65,30.18 C11.1 | C12.1 12.28,30.4 v12.28,30.18 | R2.1 23.76,18.74 23.75,18.75 23.74,18.74 C13.1 23.05,18.74 | 23.05,18.74 v23.05,19.2 | C14.1 22.49,18.74 22.5,18.75 22.51,18.74 23.05,18.74 | C15.1 v17.43,20.93 | v22.82,30.95 C17.1 | v22.73,35.77 C16.1 | RN3.5 50.72,27.17 v51.1,27.18 | C1.1 v19.07,13.55 | C1.1 v19.07,13.03 | C1.1 v19.07,12.5 | C1.1 | C1.1 v19.07,11.97 | C3.1 19.73,10.62 v18.45,11.38 | C3.1 v18.45,10.85 | C3.1 v18.45,10.32 | C3.1 v18.45,9.8 | v18.45,9.28 C3.1 | v8.05,23.48 v8.05,25.05 | v11.95,22.93 v11.95,23.45 | v11.95,23.45 v11.95,23.98 | v8.05,23.48 v8.05,21.9 | U2.4 7.08,23.48 v8.05,23.48 | U2.2 13.38,23.48 13.35,23.45 v11.95,23.45 | v4.3,34.25 v4.3,34.77 5,34.77 C2.2 | C8.1 11.96,27.68 v11.1,27.68 | C5.1 v22.75,37.12 | X4.12 24.5,5.4 v15.78,5.4 | C20.1 v41.27,8.6 | C22.1 v41.27,43.95 | C9.1 20.65,33.58 21.7,33.58 v21.7,32.6 | 24.5,47.55 24.5,48.8
  Top 0.3: v20.88,41.23 22.75,41.55 22.45,41.85 | 22.45,41.85 22.43,41.88 22.42,41.87 C6.1 22.4,41.85 v20.85,42.27 | v20.88,41.75 22.1,41.52 C6.1 22.45,41.85 | v9.85,42.92 v9.85,42.3 | v9.85,42.92 v9.85,43.55 | D3.A v9.85,42.92 | 10.53,38.3 v10.47,38.55 | 9.82,38.3 v9.8,38.55 | v9.8,38.02 9.82,38.3 | 9.82,38.3 U1.6 10.53,38.3 | 10.53,38.3 v10.47,38.02
  Top 0.35: 21.52,25.02 v21.5,25 21.48,25.02 U4.18 | U4.26 22.18,24.36 21.52,25.02 | U4.7 23.7,26.98 21.75,25.02 U4.EXP 21.52,25.02 | U4.17 20.88,25.68 21.18,25.38 | 21.52,25.02 21.18,25.38 | 21.18,25.38 21.38,25.57 19.59,27.36 U4.14 | U6.5 37.73,17.54 v37.75,17.45 | U3.53 41.23,31.51 v41.17,31.52 | C21.1 31.14,24.42 | 40.6,25.25 v40.62,25.23
  Top 0.4: U3.63 42.09,39.45 v42.98,39.45 | X5.12 25.5,46.55 24.5,47.55 | 24.5,48.8 24.5,49.23 v24.23,49.5
  Top 0.5: U3.22 26.56,36.23 27.35,36.23 v27.75,35.83 | U6.2 40.27,24.88 v40.62,25.23 41.92,25.23 C18.1 | 31.14,24.42 31.15,24.9 v31.5,25.25 | v19,9 19.75,8.25 v35.23,8.25 | 35.02,25.25 U5.2
  Top 0.6: C6.1 22.72,42.15 C19.1
  Top 0.8: v31.5,25.25 v34.85,25.25 35.02,25.25 40.6,25.25 | v31.38,18.75 27.57,18.75 26.05,20.27 v26.05,21.02
  Top 1: X1.2 24.41,13.68 19.73,13.68 19.73,13.1 | 19.73,13.1 C1.1 | C3.1 19.73,10.62 C1.1 19.73,13.1
  Bottom 0.4: 31.5,36.75 32.25,37.5 32.25,38.5 32.75,39
  other vias: 20.25,26.25 21.5,26.25 22.75,26.25 20.25,25 22.75,25 22.75,23.75 21.5,23.75 20.25,23.75 8.05,24.52 8.05,24 8.05,22.95 8.05,22.43 4.3,35.3 30.85,18.75 26.05,20.25 19.6,32.6 20.12,32.6 20.65,32.6 21.18,32.6
  pour Bottom (isolate 0.3, rank 2): 0,37.5 15.5,53 37.5,53 53,37.5 53,15.5 41.25,3.75 11.75,3.75 0,15.5
IO1.0  (via drill 0.3)
  Top 0.16: RN12.2 v34.65,12.07 | U3.51 39.63,29.86 v39.55,29.77
  Bottom 0.16: RN12.2 | RN12.2 v34.65,12.07 34.65,13.3 35.58,14.22 35.58,17.07 39.52,21.02 39.52,27.57 40.62,28.68 40.62,29.25 40.1,29.77 v39.55,29.77 | X4.3 33.5,7.05 34.65,8.85 RN12.1 RN12.2
IO1.1  (via drill 0.3)
  Top 0.16: RN12.4 v33.85,12.53 | U3.50 40.12,29.07 v40,28.98
  Bottom 0.16: X4.4 33.51,4.92 32.5,5.92 32.5,7.05 33.85,8.82 RN12.3 RN12.4 v33.85,12.53 33.85,12.97 35.25,14.38 35.25,17.2 39.2,21.15 39.2,27.7 40,28.5 v40,28.98
IO1.2  (via drill 0.3)
  Top 0.16: v33.05,12.07 RN12.6 | U3.49 39.47,28.26 v39.17,28.55
  Bottom 0.16: X4.5 31.5,7.05 33.05,8.82 RN12.5 RN12.6 v33.05,12.07 33.05,12.62 34.92,14.5 34.92,17.32 38.88,21.27 38.88,28.25 v39.17,28.55
IO1.3  (via drill 0.3)
  Top 0.16: RN12.8 32.24,11.08 v32.25,12.53 | U3.48 40.22,26.98 39.8,27.4 39.45,27.4 38.55,28.3 38.55,29.25 v38.7,29.4
  Bottom 0.16: X4.6 31.5,4.92 30.5,5.92 30.5,7.05 32.25,8.82 RN12.7 RN12.8 v32.25,12.53 32.25,13.03 32.08,13.2 32.08,16.57 32.75,17.25 34.4,17.25 38.55,21.4 38.55,29.25 v38.7,29.4
IO1.4  (via drill 0.3)
  Top 0.16: v31.12,12.07 31.12,11.12 RN5.8 | U3.47 39.43,26.97 38.23,28.18 38.23,28.7 37.8,29.12 v37.8,29.55
  Bottom 0.16: RN13.2 31.12,11.15 v31.12,12.07 31.12,12.88 31.73,13.47 31.73,16.68 32.62,17.57 34.27,17.57 38.23,21.52 38.23,28.7 37.8,29.12 v37.8,29.55 | RN13.2 31.12,11.17 | X4.7 29.5,7.05 31.1,8.82 RN13.1 RN13.2
IO1.5  (via drill 0.3)
  Top 0.16: v30.32,12.53 30.32,11.12 RN5.6 | U3.46 38.72,27.23 37.9,28.05 37.9,28.57 37.3,29.18 v36.95,29.18
  Bottom 0.16: X4.8 29.5,4.92 28.5,5.92 28.5,7.05 30.3,8.82 RN13.3 RN13.4 30.32,11.16 v30.32,12.53 31.4,13.6 31.4,16.8 32.5,17.9 34.12,17.9 37.9,21.68 37.9,28.57 37.3,29.18 v36.95,29.18
IO1.6  (via drill 0.3)
  Top 0.16: RN5.4 29.52,11.14 v29.52,12.07 | U3.45 37.9,27.57 37.27,28.2 v37.27,28.32
  Bottom 0.16: RN13.6 29.52,11.13 29.52,11.12 | 29.52,11.12 29.52,12.65 28.57,13.6 28.57,16.48 29.35,17.25 31.4,17.25 32.38,18.23 34,18.23 37.58,21.8 37.58,27.9 37.27,28.2 v37.27,28.32 | RN13.6 RN5.4 29.52,11.12 | 29.52,11.12 v29.52,12.07 | X4.9 27.5,7.05 29.5,8.82 RN13.5 RN13.6
IO1.7  (via drill 0.3)
  Top 0.16: v28.73,12.53 28.73,11.12 RN5.2 | U3.44 37.07,27.36 v36.95,27.48
  Bottom 0.16: RN13.8 28.73,11.1 28.72,12.88 28.25,13.35 28.25,16.6 29.23,17.57 31.27,17.57 32.25,18.55 33.88,18.55 37.25,21.93 37.25,27.18 v36.95,27.48 | RN13.8 28.72,11.13 v28.73,12.53 | X4.10 27.5,4.87 26.5,5.88 26.5,7.05 28.7,8.82 RN13.7 RN13.8
IO2.0  (via drill 0.3)
  Top 0.16: RN6.8 27.3,11.93 v27.15,12.07 | U3.35 29.9,25.82 v30.4,25.32
  Bottom 0.16: X4.13 23.5,7.08 27.3,9.15 RN14.1 RN6.8 27.3,11.93 v27.15,12.07 27.15,12.18 27.14,12.61 27.93,13.38 27.93,16.77 30.1,18.95 30.1,25.02 v30.4,25.32
IO2.1  (via drill 0.3)
  Top 0.16: RN6.6 26.5,11.73 26.35,11.88 v26.35,12.53 | U3.36 30.77,27.41 v30.75,27.43
  Bottom 0.16: RN6.6 | RN6.6 26.5,11.73 26.35,11.88 v26.35,12.53 26.35,12.95 25.12,14.18 25.12,16.93 25.43,17.23 27.93,17.23 29.77,19.07 29.77,26.93 30.27,27.43 v30.75,27.43 | X4.14 23.5,4.87 22.5,5.88 22.5,7.08 26.5,9.15 RN14.3 RN6.6
IO2.2  (via drill 0.3)
  Top 0.16: RN6.4 25.7,11.93 v25.55,12.07 | U3.37 31.55,27.87 v31.55,27.93
  Bottom 0.16: X4.15 21.5,7.08 25.7,9.15 RN14.5 RN6.4 25.7,11.93 v25.55,12.07 25.55,13.3 24.8,14.05 24.8,17.05 25.3,17.55 27.8,17.55 29.45,19.2 29.45,27.05 30.6,28.2 31.2,28.2 v31.55,27.93
IO2.3  (via drill 0.3)
  Top 0.16: RN6.2 24.9,11.75 24.7,11.95 v24.7,12.53 | U3.38 32.34,27.42 v32.35,27.43
  Bottom 0.16: X4.16 21.5,4.87 20.5,5.88 20.5,7.08 24.9,9.15 RN14.7 RN6.2 24.89,11.76 24.7,11.95 v24.7,12.53 24.7,13.7 24.48,13.93 24.48,17.18 25.18,17.88 27.68,17.88 29.12,19.32 29.12,27.18 30.5,28.55 31.8,28.55 32.35,28 v32.35,27.43
IO2.4  (via drill 0.3)
  Top 0.16: RN15.2 v23.73,12.07 | U3.39 33.13,27.87 v33.12,27.93
  Bottom 0.16: RN15.2 v23.73,12.07 23.73,12.78 23.35,13.15 22.6,13.15 21.45,14.3 21.45,16.85 21.82,17.23 24.05,17.23 25.02,18.2 27.55,18.2 28.77,19.43 28.77,27.27 30.38,28.88 32.48,28.88 33.12,28.23 v33.12,27.93 | X4.17 19.5,7.08 23.73,9.15 RN15.1 RN15.2 | RN15.2
IO2.5  (via drill 0.3)
  Top 0.16: RN15.4 v22.93,12.53 | U3.40 33.92,27.42 v33.92,27.43
  Bottom 0.16: 22.93,11.84 22.93,11.82 | 22.93,11.84 RN15.4 RN15.3 22.93,9.15 18.5,7.08 18.5,5.88 19.5,4.87 X4.18 | 22.93,11.84 v22.93,12.53 22.77,12.53 21.12,14.18 21.12,17 21.68,17.55 23.93,17.55 24.9,18.52 27.43,18.52 28.45,19.55 28.45,27.4 30.25,29.2 32.73,29.2 33.92,28 v33.92,27.43
IO2.6  (via drill 0.3)
  Top 0.16: RN15.6 v22.12,12.07 | U3.41 34.7,27.87 v34.7,27.93
  Bottom 0.16: X4.19 17.5,7.08 22.12,9.15 RN15.5 RN15.6 22.12,11.82 v22.12,12.07 22.12,12.72 20.8,14.05 20.8,17.12 21.55,17.88 23.8,17.88 24.77,18.85 27.3,18.85 28.12,19.68 28.12,27.52 30.12,29.52 32.88,29.52 34.48,27.93 v34.7,27.93
IO2.7  (via drill 0.3)
  Top 0.16: RN15.8 v21.32,12.53 | v34.42,28.85 34.65,28.85 35.52,27.98 U3.42
  Bottom 0.16: X4.20 17.5,4.84 16.48,5.88 16.48,7.08 21.32,9.15 RN15.7 RN15.8 v21.32,12.53 21.32,13.05 20.48,13.9 20.48,17.25 21.43,18.2 23.68,18.2 24.65,19.18 27.18,19.18 27.8,19.8 27.8,27.65 30,29.85 33,29.85 34,28.85 v34.42,28.85
IO3.0  (via drill 0.3)
  Top 0.16: X5.3 33.51,49.05 35.7,50.05 RN8.4 | U3.61 40.92,37.81 40.67,38.05 v40.67,39.05
  Bottom 0.16: X5.3 33.51,47.74 34.5,46.75 34.5,45.83 40.67,39.65 v40.67,39.05
IO3.1  (via drill 0.3)
  Top 0.16: X5.4 33.51,46.26 34.5,47.25 34.5,49.15 36.5,50.05 RN8.2 | U3.60 40.4,37.02 40.05,37.38 v40.05,38.38
  Bottom 0.16: v40.05,38.38 40.05,39.83 33.62,46.25 X5.4
IO3.2  (via drill 0.3)
  Top 0.16: X5.5 31.5,48.95 34.1,50.08 RN8.8 | v39.42,39.05 39.42,37.12 40.32,36.23 U3.59
  Bottom 0.16: X5.5 31.5,47.74 32.5,46.75 32.5,45.67 32.92,45.25 34.17,45.25 39.42,40 v39.42,39.05
IO3.3  (via drill 0.3)
  Top 0.16: X5.6 31.5,46.51 32.5,47.5 32.5,49 34.9,50.05 RN8.6 | v38.8,38.38 38.8,37.27 40.63,35.45 U3.58
  Bottom 0.16: X5.6 31.5,45.67 32,45.67 32.75,44.92 34.05,44.92 38.8,40.17 v38.8,38.38
IO3.4  (via drill 0.3)
  Top 0.16: X5.7 29.5,48.9 32,49.98 RN9.4 | v38.17,39.05 38.17,37.38 40.89,34.66 U3.57
  Bottom 0.16: v38.17,39.05 38.17,40.35 33.92,44.6 32.6,44.6 31.95,45.25 31.05,45.25 30.5,45.8 30.5,46.75 29.5,47.74 X5.7 28.18,49.58 26.82,49.58 26.5,49.25 25,49.25 24.5,48.75 24.5,47.75 24,47.25 22.93,47.25 22.5,46.83 22.5,45.7 22.95,45.25 23.95,45.25 24.46,44.74 X9.1
IO3.5  (via drill 0.3)
  Top 0.16: X5.8 29.5,46.51 30.5,47.5 30.5,48.9 32.8,49.98 RN9.2 | v37.55,38.38 37.55,37.48 41.15,33.87 U3.56
  Bottom 0.16: v37.55,38.38 37.55,40.52 33.8,44.27 32.45,44.27 31.8,44.92 30.9,44.92 29.57,46.25 X5.8 29.5,46.49 28.5,47.5 28.5,48.77 28.02,49.25 27,49.25 26.5,48.75 26.5,47.75 26,47.25 24.95,47.25 24.5,46.8 24.5,45.65 24.98,45.17 26.25,45.17 27,44.42 X9.5
IO3.6  (via drill 0.3)
  Top 0.16: X5.9 27.5,48.91 30.4,50.02 RN9.8 | v36.92,39.05 36.92,37.62 41.47,33.08 U3.55
  Bottom 0.16: 27.5,47.74 X5.9 | 27.5,47.74 28.5,46.75 28.5,45.75 29,45.25 30.1,45.25 30.75,44.6 31.68,44.6 32.33,43.95 33.65,43.95 36.92,40.67 v36.92,39.05 | 27.52,47.74 27.52,47.75 | 27.52,47.74 27.5,47.74 | 27.52,47.74 26.5,46.73 26.5,45.77 27.02,45.25 27.35,45.25 27.66,44.94 27.66,41.64 27.52,41.5 26.4,41.5 25.73,42.17 X9.3
IO3.7  (via drill 0.3)
  Top 0.16: X5.10 27.5,46.51 28.5,47.5 28.5,48.9 31.2,50 RN9.6 | v36.3,38.38 36.3,37.8 41.1,33 41.1,32.83 41.63,32.3 U3.54
  Bottom 0.16: 29.6,44.27 29.45,44.27 29.45,44.3 X5.10 | 29.6,44.27 31.52,44.27 32.17,43.62 33.52,43.62 36.3,40.85 v36.3,38.38 | X9.9 29.54,44.22 29.6,44.27
IO4.0/PDI  (via drill 0.3)
  Top 0.16: RN10.2 22.6,49.65 23.5,48.74 X5.13 23.5,47.74 24.5,46.75 24.5,45.75 25,45.25 36.92,45.25 39.43,42.75 U3.2 39.43,41.43 38.8,40.8 33.85,40.8 33.83,40.77 33.83,38.23 34.5,37.55 34.5,36.42 v35.17,35.75 | X3.4 45.66,18.93 47.2,18.93 47.77,19.5 47.77,24.27 v47.48,24.57
  Bottom 0.16: v35.17,35.75 35.17,35.33 35.62,34.88 38.77,34.88 39.05,35.15 41.52,35.15 43.35,36.98 43.35,37.92 44.1,38.67 47.25,38.67 48.35,37.58 48.35,26.4 47.48,25.52 v47.48,24.57
IO4.1/PDO  (via drill 0.3)
  Top 0.16: RN10.4 21.8,49.38 22.5,48.67 22.5,47.5 23.5,46.49 X5.14 23.5,45.74 24.32,44.92 36.48,44.92 38.64,42.76 U3.3 38.64,41.44 38.33,41.12 33.73,41.12 33.5,40.9 33.5,38.1 34.17,37.42 34.17,36.3 34.55,35.92 34.55,35.5 34.95,35.1 35.65,35.1 v36.05,35.5 | X3.1 48.1,17.36 v48.1,25.27
  Bottom 0.16: v36.05,35.5 36.35,35.2 38.65,35.2 38.92,35.48 41.4,35.48 43,37.08 43,38.02 43.98,39 47.38,39 48.67,37.7 48.67,26.27 48.1,25.7 v48.1,25.27
IO4.2
  Top 0.16: RN10.6 21,49.17 21.5,48.67 X5.15 21.5,47.74 22.5,46.75 22.5,45.75 23.65,44.6 36.02,44.6 37.85,42.77 U3.4
IO4.3
  Top 0.16: RN10.8 20.2,49.12 20.5,48.83 20.5,47.5 21.5,46.5 X5.16 21.5,45.74 22.98,44.27 35.52,44.27 37.07,42.73 U3.5
IO4.4
  Top 0.16: X5.17 | X5.17 19.5,47.76 19.5,47.75 20.5,46.75 20.5,45.75 22.3,43.95 35.08,43.95 36.28,42.75 U3.6 | X5.17 19.5,48.67 18.9,49.27 RN11.2
IO4.5
  Top 0.16: X5.18 | X5.18 19.5,45.75 21.62,43.62 34.62,43.62 35.49,42.76 U3.7 | X5.18 19.5,46.49 18.5,47.5 18.5,48.67 18.1,49.08 RN11.4
IO4.6
  Top 0.16: RN11.6 17.3,48.88 17.5,48.67 X5.19 17.5,47.76 17.5,47.75 18.5,46.75 18.5,45.75 20.95,43.3 34.15,43.3 34.7,42.75 U3.8
IO4.7
  Top 0.16: X5.20 | X5.20 18.02,45.75 20.8,42.98 33.67,42.98 33.92,42.73 U3.9 | X5.20 17.5,46.55 16.5,47.55 RN11.8
IRR  (via drill 0.3)
  Top 0.16: X8.2 48.42,21.77 48.42,24.27 v48.73,24.57 48.95,24.8 48.95,25.43 RN3.2 | v28.52,32.45 28.45,32.45 27.03,33.87 U3.25
  Bottom 0.16: v28.52,32.45 28.52,32.7 28.68,32.85 31.38,32.85 32.42,33.9 35.65,33.9 36.3,34.55 38.9,34.55 39.17,34.83 41.7,34.83 43.67,36.8 43.67,37.75 44.27,38.35 47.12,38.35 48,37.48 48,26.5 46.85,25.35 46.85,24.27 47.17,23.95 48.1,23.95 v48.73,24.57
KEY  (via drill 0.3)
  Top 0.16: R5.2 v27.18,22.52
  Bottom 0.16: U$1.1 19,16.23 21.3,18.52 23.52,18.52 24.5,19.5 27.05,19.5 27.48,19.93 27.48,22.38 v27.18,22.52
LCDCLK  (via drill 0.3)
  Top 0.16: v38.1,32.3 37.48,32.92 36.27,32.92 34.98,34.23 34,34.23 31.68,36.55 31.68,39.88 29.98,41.57 U3.14
  Bottom 0.16: X6.3 45.66,32.33 44.12,32.33 43.58,32.88 39.92,32.88 39.65,32.6 38.4,32.6 v38.1,32.3
LCDCS  (via drill 0.3)
  Top 0.16: v36.38,31.77 36.27,31.68 35.3,31.68 34.95,32.02 34.95,32.9 34.62,33.23 33.65,33.23 30.65,36.23 30.65,38.75 29.23,40.17 26.55,40.17 U3.17
  Bottom 0.16: v36.38,31.77 36.38,32.38 36.92,32.92 39.52,32.92 39.8,33.2 44.53,33.2 X6.6
LCDSDI  (via drill 0.3)
  Top 0.16: v37.17,32.3 36.92,32.55 36.2,32.55 34.85,33.9 33.88,33.9 31.32,36.45 31.32,39.42 29.19,41.56 U3.15
  Bottom 0.16: X6.4 43.42,32.55 40.05,32.55 39.17,31.68 37.8,31.68 v37.17,32.3
LCDSDO  (via drill 0.3)
  Top 0.16: v35.58,32.3 35.58,32.73 34.73,33.58 33.75,33.58 30.98,36.35 30.98,38.98 28.33,41.62 U3.16
  Bottom 0.16: X6.5 45.66,34.33 44.25,34.33 43.45,33.52 39.67,33.52 39.4,33.25 36.8,33.25 35.85,32.3 v35.58,32.3
LED
  Top 0.16: 26.55,28.35 | 26.55,28.35 U3.32 | 26.55,28.35 26.9,28.35 27.27,27.98 27.27,24.82 27.88,24.22 27.88,24.18 | R5.1 27.88,24.18 | 27.88,24.18 R1.2
LEDA  (1 unrouted)
  Top 0.16: 15.52,20.02 17.07,21.57 20,21.57 20.23,21.81 U4.23
LEDB  (via drill 0.3)
  Top 0.16: U4.22 19.57,22.23 19.57,21.9 17.45,21.9 v17.15,22.2
  Bottom 0.16: v17.15,22.2 16.88,22.48 16.88,26.24 16.62,26.5 15.75,26.5 15.53,26.73 X10.12
MISO  (via drill 0.3)
  Top 0.16: v34.33,34.85 33.85,34.85 32,36.7 32,40.35 30.77,41.58 U3.13 | U4.2 25.88,23.73 v25.9,23.75
  Bottom 0.16: v25.9,23.75 26.2,24.05 26.2,26.85 25.88,27.18 25.88,27.73 26.48,28.32 26.48,31.85 28.12,33.5 29.3,33.5 30.4,34.6 34.08,34.6 v34.33,34.85
MOSI  (via drill 0.3)
  Top 0.16: v33.92,35.67 33.48,35.67 32.33,36.83 32.33,40.83 31.55,41.6 U3.12 | U4.3 v25.23,24.38
  Bottom 0.16: v25.23,24.38 25.57,24.38 25.88,24.68 25.88,26.68 25.55,27 25.55,27.85 26.12,28.43 26.12,31.95 28,33.83 29.18,33.83 30.27,34.92 33.17,34.92 v33.92,35.67
N$1
  Top 0.16: U4.27 22.84,21.77 23.05,21.55 23.77,21.55 24.3,22.07 25.62,22.07 TP1.TP
N$7  (via drill 0.3)
  Top 0.16: RN1.2 8.36,32.17 | 9.15,32.17 RN1.4 | 13.68,32.5 C11.2 13.72,31.95
  Top 0.3: v7.33,31.4 8.07,32.15 RN1.2 | 8.36,32.17 9.15,32.17 | RN1.4 9.14,32.55 9.82,33.23 12.95,33.23 13.68,32.5 | L2.2 16.36,31.95 13.72,31.95
  Bottom 0.3: X10.4 5.54,28.43 7.1,30 7.1,31.18 v7.33,31.4
N$8
  Top 0.16: 12.46,32.16 12.53,32.1 C12.2 12.28,32.35 12.28,32.16 RN1.8 | RN1.8 | RN1.6 RN1.8
N$14
  Top 0.16: R1.1 29.08,23.05 29.07,23.05 29.09,23.04 LED1.C
N$23  (via drill 0.3)
  Top 0.16: U5.8 36.3,17.75 v36.73,17.35 | v39.8,20.4 40.1,20.1 42.85,20.1 44,21.25 47.02,21.25 47.12,21.35 47.12,23.55 46.48,24.2 46.48,24.98 48.67,27.18 RN3.6
  Bottom 0.16: v36.73,17.35 36.73,17.73 39.4,20.4 v39.8,20.4
N$24
  Top 0.16: SJ1.2 38.98,11.75 40.37,11.75 R3.1
N$25  (via drill 0.3)
  Top 0.16: RN2.3 15.57,27.27 | 15.57,27.27 RN2.3 | RN2.3 15.59,27.26 15.57,27.25 v16.23,27.25
  Bottom 0.16: v16.23,27.25 15.93,27.55 15.93,29.43 16.57,30.07 16.57,32.22 X10.11
N$26
  Top 0.16: SJ2.2 R4.1
N$29  (via drill 0.3)
  Top 0.16: RN2.7 v16.23,25.65
  Bottom 0.16: v16.23,25.65 16.55,25.32 16.55,23.48 X10.13
OSC1  (via drill 0.3)
  Top 0.16: v17.88,24.5 18,24.38 U4.19 | v18.8,19.3 Q1.1 18.63,18.75 C15.2
  Bottom 0.16: v18.8,19.3 18.8,20.9 17.88,21.82 17.88,22.7 17.27,23.3 17.27,23.82 17.88,24.43 v17.88,24.5
OSC2  (via drill 0.3)
  Top 0.16: v17.9,23.57 18.05,23.73 U4.20 | v20.7,21.07 20.73,20.3 20.74,20.39 Q1.3 21.18,20.2 C14.2
  Bottom 0.16: v17.9,23.57 18.2,23.27 18.2,21.95 19.07,21.07 v20.7,21.07
OW  (via drill 0.3)
  Top 0.16: v31.57,33.98 31.57,34.38 30,35.95 30,38.48 29.88,38.6 26.55,38.6 U3.19 | RN3.8 49,27.98 49,31.8 50.2,32.99 50.2,33 X7.2
  Bottom 0.16: v31.57,33.98 31.82,34.23 34.58,34.23 34.95,34.6 34.95,35.1 34.55,35.5 34.55,36.02 34.9,36.38 36.05,36.38 36.9,35.52 38.52,35.52 38.8,35.8 41.27,35.8 42.67,37.2 42.67,38.15 43.85,39.33 47.5,39.33 49,37.83 49,34.2 50.2,32.99 X7.2
RBIAS  (via drill 0.3)
  Top 0.16: U4.10 22.18,28.59 v22.18,28.73 | R2.2 24.6,20.21 24.6,21.3 v24.5,21.4
  Bottom 0.16: v22.18,28.73 23.65,27.25 23.65,22.23 v24.5,21.4
RS485A
  Top 0.16: R4.2 | R4.2 | U6.7 40.27,15.97 40.5,15.75 | X1.6 40.5,15.75 | R4.2 41.85,14.4 40.5,15.75
RS485B
  Top 0.16: U6.6 39.01,17.5 37.25,15.75 37,15.75 | 37,15.75 X1.5 | SJ2.1 38.04,14.71 37,15.75
RS485RX  (via drill 0.3)
  Top 0.16: U6.1 | v28.23,31.2 28.12,31.2 27.03,32.3 U3.27 | v41.17,22.98 41.55,23.35 U6.1
  Bottom 0.16: v28.23,31.2 28.4,31.02 29.38,31.02 29.5,31.15 34.45,31.15 35.42,30.18 39.02,30.18 39.25,30.4 39.92,30.4 40.95,29.38 40.95,28.5 39.88,27.43 39.88,24.27 v41.17,22.98
RS485TE  (via drill 0.3)
  Top 0.16: U3.29 27.1,30.72 v27.9,29.93 | U6.3 39.01,23.75 37.25,22 36.33,22 v35.7,22.62
  Bottom 0.16: v27.9,29.93 28.07,29.75 29,29.75 29.75,30.5 34.17,30.5 35.92,28.75 35.92,25.02 36.6,24.35 36.6,23.52 v35.7,22.62
RS485TX  (via drill 0.3)
  Top 0.16: U3.28 27.04,31.51 28,30.55 28.57,30.55 v28.73,30.4 | U6.4 37.73,22.96 37.4,22.62 v36.62,22.62
  Bottom 0.16: v28.73,30.4 29.2,30.4 29.62,30.82 34.33,30.82 36.25,28.9 36.25,25.15 36.92,24.48 36.92,22.93 v36.62,22.62
SCK  (via drill 0.3)
  Top 0.16: X3.3 45.67,16.93 44.12,16.93 43.58,17.48 43.58,19.23 43.35,19.45 28.02,19.45 26.8,20.68 26.8,21.45 26.2,22.05 26.2,23.05 26.52,23.38 26.52,24.6 26.12,25 25.55,25 v25.25,25.3 24.98,25.02 U4.4 | v33.55,36.52 33.12,36.52 32.67,36.98 32.67,41.08 32.34,41.41 U3.11
  Bottom 0.16: v25.25,25.3 25.23,25.3 25.23,27.98 25.8,28.55 25.8,32.1 27.85,34.15 29.05,34.15 30.15,35.25 32.75,35.25 33.25,35.75 33.25,36.23 v33.55,36.52
TPIN+  (via drill 0.3)
  Top 0.16: U4.9 22.84,28.94 22.35,29.43 21.02,29.43 20.77,29.18 11,29.18 9.95,30.23 RN1.5 10.05,30.61 v10.05,31.18
  Bottom 0.16: X10.1 2.04,31.61 3.98,29.68 6.15,29.68 6.7,30.23 6.7,31.73 7,32.02 9.53,32.02 10.05,31.5 v10.05,31.18
TPIN-  (via drill 0.3)
  Top 0.16: U4.8 23.48,28.74 22.48,29.75 20.9,29.75 20.65,29.5 11.32,29.5 10.74,30.08 RN1.7 10.75,30.75 v11.15,31.15
  Bottom 0.16: X10.2 5.53,31 6.88,32.35 9.95,32.35 v11.15,31.15
TPOUT+  (via drill 0.3)
  Top 0.16: U4.13 20.23,28.19 19.9,28.52 10.07,28.52 8.35,30.25 RN1.1 8.35,30.7 v7.92,30.7
  Bottom 0.16: X10.5 4.84,27.16 7.92,30.25 v7.92,30.7
TPOUT-  (via drill 0.3)
  Top 0.16: U4.12 20.89,28.16 20.2,28.85 10.55,28.85 9.14,30.25 RN1.3 | v9.05,31.18 9.05,30.55 RN1.3 | RN1.3 | RN1.3
  Bottom 0.16: X10.6 4.58,26.45 9.05,30.93 v9.05,31.18
VCAP
  Top 0.16: U4.25 21.54,21.84 21.85,21.52 22.57,21.52 23.7,20.4 C13.2
VIN
  Top 0.3: C2.1 1.51,34.1 | 7.42,40.05 7.42,40.2 4.72,40.2 | 4.75,38.92 7.22,38.92 | 4.83,37.65 7.17,37.65
  Top 0.6: U1.7 7.42,39.57 7.42,40.05
  Top 1: C3.2 16.42,10.33 | 15.93,15.78 D1.C
  pour Top (isolate 0.4): 2.88,40.38 10.45,40.38 10.45,38.85 8.6,38.85 7.15,37.4 4.67,37.4 3.55,36.27 3.55,19.38 6.47,16.45 16.5,16.45 16.5,9.03 6.5,9.03 0.03,15.5 0.03,37.52
VSUP
  Top 0.6: D1.A 20.35,15.75 22.98,15.75 X1.1
  Top 1: D1.A | D1.A | C1.2 18.93,15.78 D1.A
VSW  (via drill 0.6)
  Top 0.6: 13.4,40.84 U1.8 | 13.4,40.84 D3.C | 13.4,40.84 14.18,40.84 v14.18,38.62
  Bottom 0.6: L1.2 v14.18,38.62
  pour Top (isolate 0.3): 11.25,40.75 11.25,45.75 14,45.75 15.75,44 15.75,37.25 12.75,37.25 12.75,40.75
XTAL1
  Top 0.16: U3.24 25.96,34.66 25.65,34.35 25.65,33.52 24.88,32.75 24.88,32.38 24.75,32.25 24.79,32.22 | 24.79,32.22 Q2.1 | C17.2 24.73,30.85 24.79,30.91 24.79,32.22
XTAL2
  Top 0.16: 23.08,34.01 Q2.3 23.36,34.41 24.73,35.77 C16.2 25.2,35.45 U3.23

### Text on the board
Bottom: sautter.com